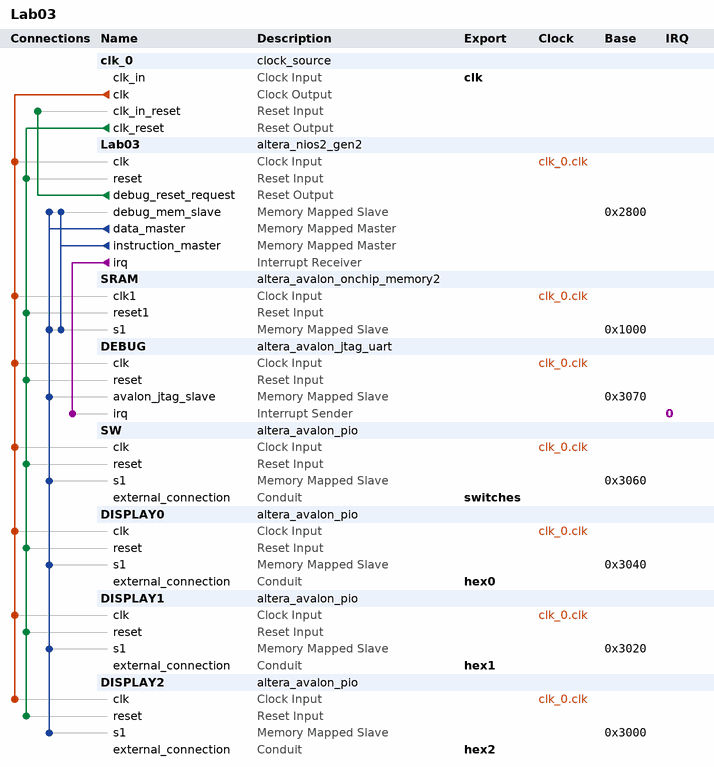
[diagram p0: system contents]
# Platform Designer (Qsys) system Lab03, Cyclone V 5CSXFC6D6F31C6
# Parameters at their usual value, and those the tool derives, are not listed.
package require -exact qsys 22.1
create_system Lab03
set_project_property DEVICE_FAMILY {Cyclone V}
set_project_property DEVICE 5CSXFC6D6F31C6

add_instance clk_0 clock_source 22.1
set_instance_parameter_value clk_0 clockFrequency 50000000

add_instance Lab03 altera_nios2_gen2 22.1
set_instance_parameter_value Lab03 dcache_size 2048
set_instance_parameter_value Lab03 exceptionSlave SRAM.s1
set_instance_parameter_value Lab03 icache_size 4096
set_instance_parameter_value Lab03 impl Tiny
set_instance_parameter_value Lab03 resetSlave SRAM.s1

add_instance SRAM altera_avalon_onchip_memory2 22.1
set_instance_parameter_value SRAM dataWidth 32
set_instance_parameter_value SRAM dualPort false
set_instance_parameter_value SRAM initMemContent true
set_instance_parameter_value SRAM initializationFileName onchip_mem.hex
set_instance_parameter_value SRAM memorySize 4096

add_instance DEBUG altera_avalon_jtag_uart 22.1
set_instance_parameter_value DEBUG simInteractiveOptions NO_INTERACTIVE_WINDOWS

add_instance SW altera_avalon_pio 22.1
set_instance_parameter_value SW captureEdge true
set_instance_parameter_value SW direction Input
set_instance_parameter_value SW edgeType ANY
set_instance_parameter_value SW simDoTestBenchWiring true
set_instance_parameter_value SW width 10

add_instance DISPLAY0 altera_avalon_pio 22.1
set_instance_parameter_value DISPLAY0 bitModifyingOutReg true
set_instance_parameter_value DISPLAY0 direction Output
set_instance_parameter_value DISPLAY0 resetValue 127
set_instance_parameter_value DISPLAY0 width 7

add_instance DISPLAY1 altera_avalon_pio 22.1
set_instance_parameter_value DISPLAY1 bitModifyingOutReg true
set_instance_parameter_value DISPLAY1 direction Output
set_instance_parameter_value DISPLAY1 resetValue 127
set_instance_parameter_value DISPLAY1 width 7

add_instance DISPLAY2 altera_avalon_pio 22.1
set_instance_parameter_value DISPLAY2 bitModifyingOutReg true
set_instance_parameter_value DISPLAY2 direction Output
set_instance_parameter_value DISPLAY2 resetValue 127
set_instance_parameter_value DISPLAY2 width 7

# connections
add_connection clk_0.clk DEBUG.clk clock
add_connection clk_0.clk DISPLAY0.clk clock
add_connection clk_0.clk DISPLAY1.clk clock
add_connection clk_0.clk DISPLAY2.clk clock
add_connection clk_0.clk Lab03.clk clock
add_connection clk_0.clk SRAM.clk1 clock
add_connection clk_0.clk SW.clk clock
add_connection clk_0.clk_reset DEBUG.reset reset
add_connection clk_0.clk_reset DISPLAY0.reset reset
add_connection clk_0.clk_reset DISPLAY1.reset reset
add_connection clk_0.clk_reset DISPLAY2.reset reset
add_connection clk_0.clk_reset Lab03.reset reset
add_connection clk_0.clk_reset SRAM.reset1 reset
add_connection clk_0.clk_reset SW.reset reset
add_connection Lab03.debug_reset_request clk_0.clk_in_reset reset
add_connection Lab03.data_master DEBUG.avalon_jtag_slave avalon
set_connection_parameter_value Lab03.data_master/DEBUG.avalon_jtag_slave baseAddress 0x3070
add_connection Lab03.data_master DISPLAY0.s1 avalon
set_connection_parameter_value Lab03.data_master/DISPLAY0.s1 baseAddress 0x3040
add_connection Lab03.data_master DISPLAY1.s1 avalon
set_connection_parameter_value Lab03.data_master/DISPLAY1.s1 baseAddress 0x3020
add_connection Lab03.data_master DISPLAY2.s1 avalon
set_connection_parameter_value Lab03.data_master/DISPLAY2.s1 baseAddress 0x3000
add_connection Lab03.data_master Lab03.debug_mem_slave avalon
set_connection_parameter_value Lab03.data_master/Lab03.debug_mem_slave baseAddress 0x2800
add_connection Lab03.data_master SRAM.s1 avalon
set_connection_parameter_value Lab03.data_master/SRAM.s1 baseAddress 0x1000
add_connection Lab03.data_master SW.s1 avalon
set_connection_parameter_value Lab03.data_master/SW.s1 baseAddress 0x3060
add_connection Lab03.instruction_master Lab03.debug_mem_slave avalon
set_connection_parameter_value Lab03.instruction_master/Lab03.debug_mem_slave baseAddress 0x2800
add_connection Lab03.instruction_master SRAM.s1 avalon
set_connection_parameter_value Lab03.instruction_master/SRAM.s1 baseAddress 0x1000
add_connection Lab03.irq DEBUG.irq interrupt
set_connection_parameter_value Lab03.irq/DEBUG.irq irqNumber 0

# exported interfaces
add_interface clk clock sink
set_interface_property clk EXPORT_OF clk_0.clk_in
add_interface hex0 conduit end
set_interface_property hex0 EXPORT_OF DISPLAY0.external_connection
add_interface hex1 conduit end
set_interface_property hex1 EXPORT_OF DISPLAY1.external_connection
add_interface hex2 conduit end
set_interface_property hex2 EXPORT_OF DISPLAY2.external_connection
add_interface switches conduit end
set_interface_property switches EXPORT_OF SW.external_connection

set_interconnect_requirement {$system} qsys_mm.clockCrossingAdapter HANDSHAKE
set_interconnect_requirement {$system} qsys_mm.enableEccProtection FALSE
set_interconnect_requirement {$system} qsys_mm.insertDefaultSlave FALSE
set_interconnect_requirement {$system} qsys_mm.maxAdditionalLatency 1

save_system Lab03.qsys
